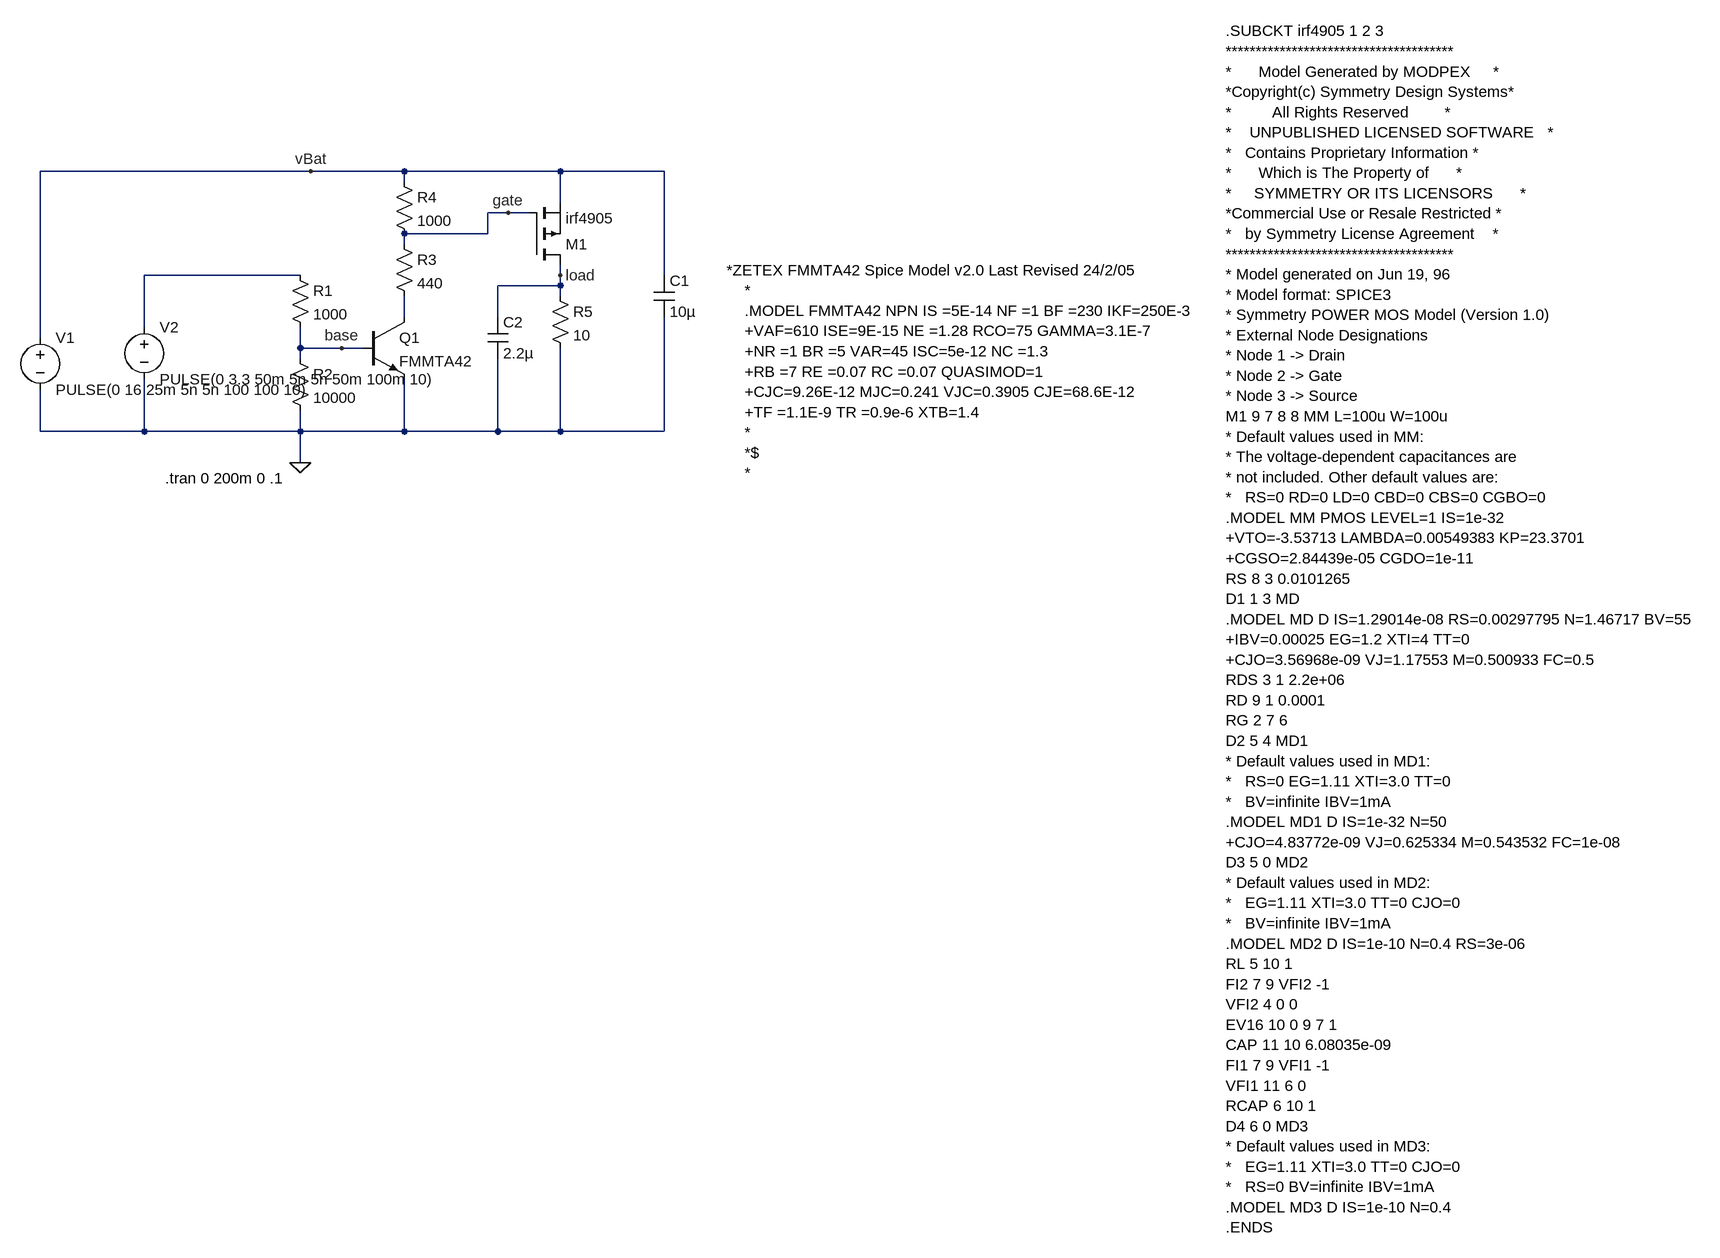
[diagram p0: schematic HighSideDriver_Improved.asc]
HighSideDriver_Improved.asc, the LTspice schematic file:
Version 4
SHEET 1 2308 1356
WIRE 176 -96 -240 -96
WIRE 320 -96 176 -96
WIRE 560 -96 320 -96
WIRE 720 -96 560 -96
WIRE 320 -80 320 -96
WIRE 560 -48 560 -96
WIRE 480 -32 448 -32
WIRE 512 -32 480 -32
WIRE 448 0 448 -32
WIRE 448 0 320 0
WIRE 320 16 320 0
WIRE 160 64 -80 64
WIRE 560 64 560 48
WIRE 720 64 720 -96
WIRE 560 80 560 64
WIRE 560 80 464 80
WIRE 560 96 560 80
WIRE 320 128 320 96
WIRE 464 128 464 80
WIRE -80 144 -80 64
WIRE -240 160 -240 -96
WIRE 160 176 160 144
WIRE 224 176 160 176
WIRE 256 176 224 176
WIRE 160 192 160 176
WIRE -240 304 -240 240
WIRE -80 304 -80 224
WIRE -80 304 -240 304
WIRE 160 304 160 272
WIRE 160 304 -80 304
WIRE 320 304 320 224
WIRE 320 304 160 304
WIRE 464 304 464 192
WIRE 464 304 320 304
WIRE 560 304 560 176
WIRE 560 304 464 304
WIRE 720 304 720 128
WIRE 720 304 560 304
WIRE 160 352 160 304
FLAG 160 352 0
FLAG 176 -96 vBat
FLAG 480 -32 gate
FLAG 224 176 base
FLAG 560 64 load
SYMBOL res 144 48 R0
SYMATTR InstName R1
SYMATTR Value 1000
SYMBOL res 144 176 R0
SYMATTR InstName R2
SYMATTR Value 10000
SYMBOL voltage -240 144 R0
WINDOW 123 0 0 Left 2
WINDOW 39 0 0 Left 2
SYMATTR InstName V1
SYMATTR Value PULSE(0 16 25m 5n 5n 100 100 10)
SYMBOL npn 256 128 R0
SYMATTR InstName Q1
SYMATTR Value FMMTA42
SYMBOL res 304 0 R0
SYMATTR InstName R3
SYMATTR Value 440
SYMBOL voltage -80 128 R0
WINDOW 123 0 0 Left 2
WINDOW 39 0 0 Left 2
SYMATTR InstName V2
SYMATTR Value PULSE(0 3.3 50m 5n 5n 50m 100m 10)
SYMBOL res 544 80 R0
SYMATTR InstName R5
SYMATTR Value 10
SYMBOL cap 448 128 R0
SYMATTR InstName C2
SYMATTR Value 2.2µ
SYMBOL pmos 512 48 M180
SYMATTR InstName M1
SYMATTR Value irf4905
SYMATTR Prefix X
SYMBOL res 304 -96 R0
SYMATTR InstName R4
SYMATTR Value 1000
SYMBOL cap 704 64 R0
SYMATTR InstName C1
SYMATTR Value 10µ
TEXT -48 376 Left 2 !.tran 0 200m 0 .1
TEXT 816 56 Left 2 !*ZETEX FMMTA42 Spice Model v2.0 Last Revised 24/2/05\n    *\n    .MODEL FMMTA42 NPN IS =5E-14 NF =1 BF =230 IKF=250E-3\n    +VAF=610 ISE=9E-15 NE =1.28 RCO=75 GAMMA=3.1E-7\n    +NR =1 BR =5 VAR=45 ISC=5e-12 NC =1.3 \n    +RB =7 RE =0.07 RC =0.07 QUASIMOD=1\n    +CJC=9.26E-12 MJC=0.241 VJC=0.3905 CJE=68.6E-12 \n    +TF =1.1E-9 TR =0.9e-6 XTB=1.4 \n    *\n    *$\n    *
TEXT 1584 -312 Left 2 !.SUBCKT irf4905 1 2 3\n**************************************\n*      Model Generated by MODPEX     *\n*Copyright(c) Symmetry Design Systems*\n*         All Rights Reserved        *\n*    UNPUBLISHED LICENSED SOFTWARE   *\n*   Contains Proprietary Information *\n*      Which is The Property of      *\n*     SYMMETRY OR ITS LICENSORS      *\n*Commercial Use or Resale Restricted *\n*   by Symmetry License Agreement    *\n**************************************\n* Model generated on Jun 19, 96\n* Model format: SPICE3\n* Symmetry POWER MOS Model (Version 1.0)\n* External Node Designations\n* Node 1 -> Drain\n* Node 2 -> Gate\n* Node 3 -> Source\nM1 9 7 8 8 MM L=100u W=100u\n* Default values used in MM:\n* The voltage-dependent capacitances are\n* not included. Other default values are:\n*   RS=0 RD=0 LD=0 CBD=0 CBS=0 CGBO=0\n.MODEL MM PMOS LEVEL=1 IS=1e-32\n+VTO=-3.53713 LAMBDA=0.00549383 KP=23.3701\n+CGSO=2.84439e-05 CGDO=1e-11\nRS 8 3 0.0101265\nD1 1 3 MD\n.MODEL MD D IS=1.29014e-08 RS=0.00297795 N=1.46717 BV=55\n+IBV=0.00025 EG=1.2 XTI=4 TT=0\n+CJO=3.56968e-09 VJ=1.17553 M=0.500933 FC=0.5\nRDS 3 1 2.2e+06\nRD 9 1 0.0001\nRG 2 7 6\nD2 5 4 MD1\n* Default values used in MD1:\n*   RS=0 EG=1.11 XTI=3.0 TT=0\n*   BV=infinite IBV=1mA\n.MODEL MD1 D IS=1e-32 N=50\n+CJO=4.83772e-09 VJ=0.625334 M=0.543532 FC=1e-08\nD3 5 0 MD2\n* Default values used in MD2:\n*   EG=1.11 XTI=3.0 TT=0 CJO=0\n*   BV=infinite IBV=1mA\n.MODEL MD2 D IS=1e-10 N=0.4 RS=3e-06\nRL 5 10 1\nFI2 7 9 VFI2 -1\nVFI2 4 0 0\nEV16 10 0 9 7 1\nCAP 11 10 6.08035e-09\nFI1 7 9 VFI1 -1\nVFI1 11 6 0\nRCAP 6 10 1\nD4 6 0 MD3\n* Default values used in MD3:\n*   EG=1.11 XTI=3.0 TT=0 CJO=0\n*   RS=0 BV=infinite IBV=1mA\n.MODEL MD3 D IS=1e-10 N=0.4\n.ENDS

The netlist it stands for:
* HighSideDriver_Improved.asc
R1 N001 base 1000
R2 base 0 10000
V1 vBat 0 PULSE(0 16 25m 5n 5n 100 100 10)
Q1 N002 base 0 0 FMMTA42
R3 gate N002 440
V2 N001 0 PULSE(0 3.3 50m 5n 5n 50m 100m 10)
R5 load 0 10
C2 load 0 2.2µ
XM1 load gate vBat irf4905  ; pins D G S
R4 vBat gate 1000
C1 vBat 0 10µ
.model NPN NPN
.model PNP PNP
.lib standard.bjt
.tran 0 200m 0 .1
*ZETEX FMMTA42 Spice Model v2.0 Last Revised 24/2/05
    *
    .MODEL FMMTA42 NPN IS =5E-14 NF =1 BF =230 IKF=250E-3
    +VAF=610 ISE=9E-15 NE =1.28 RCO=75 GAMMA=3.1E-7
    +NR =1 BR =5 VAR=45 ISC=5e-12 NC =1.3
    +RB =7 RE =0.07 RC =0.07 QUASIMOD=1
    +CJC=9.26E-12 MJC=0.241 VJC=0.3905 CJE=68.6E-12
    +TF =1.1E-9 TR =0.9e-6 XTB=1.4
    *
    *$
    *
.SUBCKT irf4905 1 2 3
**************************************
*      Model Generated by MODPEX     *
*Copyright(c) Symmetry Design Systems*
*         All Rights Reserved        *
*    UNPUBLISHED LICENSED SOFTWARE   *
*   Contains Proprietary Information *
*      Which is The Property of      *
*     SYMMETRY OR ITS LICENSORS      *
*Commercial Use or Resale Restricted *
*   by Symmetry License Agreement    *
**************************************
* Model generated on Jun 19, 96
* Model format: SPICE3
* Symmetry POWER MOS Model (Version 1.0)
* External Node Designations
* Node 1 -> Drain
* Node 2 -> Gate
* Node 3 -> Source
M1 9 7 8 8 MM L=100u W=100u
* Default values used in MM:
* The voltage-dependent capacitances are
* not included. Other default values are:
*   RS=0 RD=0 LD=0 CBD=0 CBS=0 CGBO=0
.MODEL MM PMOS LEVEL=1 IS=1e-32
+VTO=-3.53713 LAMBDA=0.00549383 KP=23.3701
+CGSO=2.84439e-05 CGDO=1e-11
RS 8 3 0.0101265
D1 1 3 MD
.MODEL MD D IS=1.29014e-08 RS=0.00297795 N=1.46717 BV=55
+IBV=0.00025 EG=1.2 XTI=4 TT=0
+CJO=3.56968e-09 VJ=1.17553 M=0.500933 FC=0.5
RDS 3 1 2.2e+06
RD 9 1 0.0001
RG 2 7 6
D2 5 4 MD1
* Default values used in MD1:
*   RS=0 EG=1.11 XTI=3.0 TT=0
*   BV=infinite IBV=1mA
.MODEL MD1 D IS=1e-32 N=50
+CJO=4.83772e-09 VJ=0.625334 M=0.543532 FC=1e-08
D3 5 0 MD2
* Default values used in MD2:
*   EG=1.11 XTI=3.0 TT=0 CJO=0
*   BV=infinite IBV=1mA
.MODEL MD2 D IS=1e-10 N=0.4 RS=3e-06
RL 5 10 1
FI2 7 9 VFI2 -1
VFI2 4 0 0
EV16 10 0 9 7 1
CAP 11 10 6.08035e-09
FI1 7 9 VFI1 -1
VFI1 11 6 0
RCAP 6 10 1
D4 6 0 MD3
* Default values used in MD3:
*   EG=1.11 XTI=3.0 TT=0 CJO=0
*   RS=0 BV=infinite IBV=1mA
.MODEL MD3 D IS=1e-10 N=0.4
.ENDS
.backanno
.end